# Altium schematic sheet Acoustics Board Pg. 2.SchDoc: Sample Sheet Title
size B; Date: MM/DD/YYYY; Author: Nathan A, Rebecca Y, Rebecca L; Organization: ORGANIZATION; Address1: ADDRESS 1; Address2: ADDRESS 2; Address3: ADDRESS 3; Address4: ADDRESS 4; Revision: -; SheetNumber: 1; SheetTotal: 5; ENG_APP_DATE: --/--/--; DSN_APP_DATE: --/--/--; CHK_APP_DATE: --/--/--
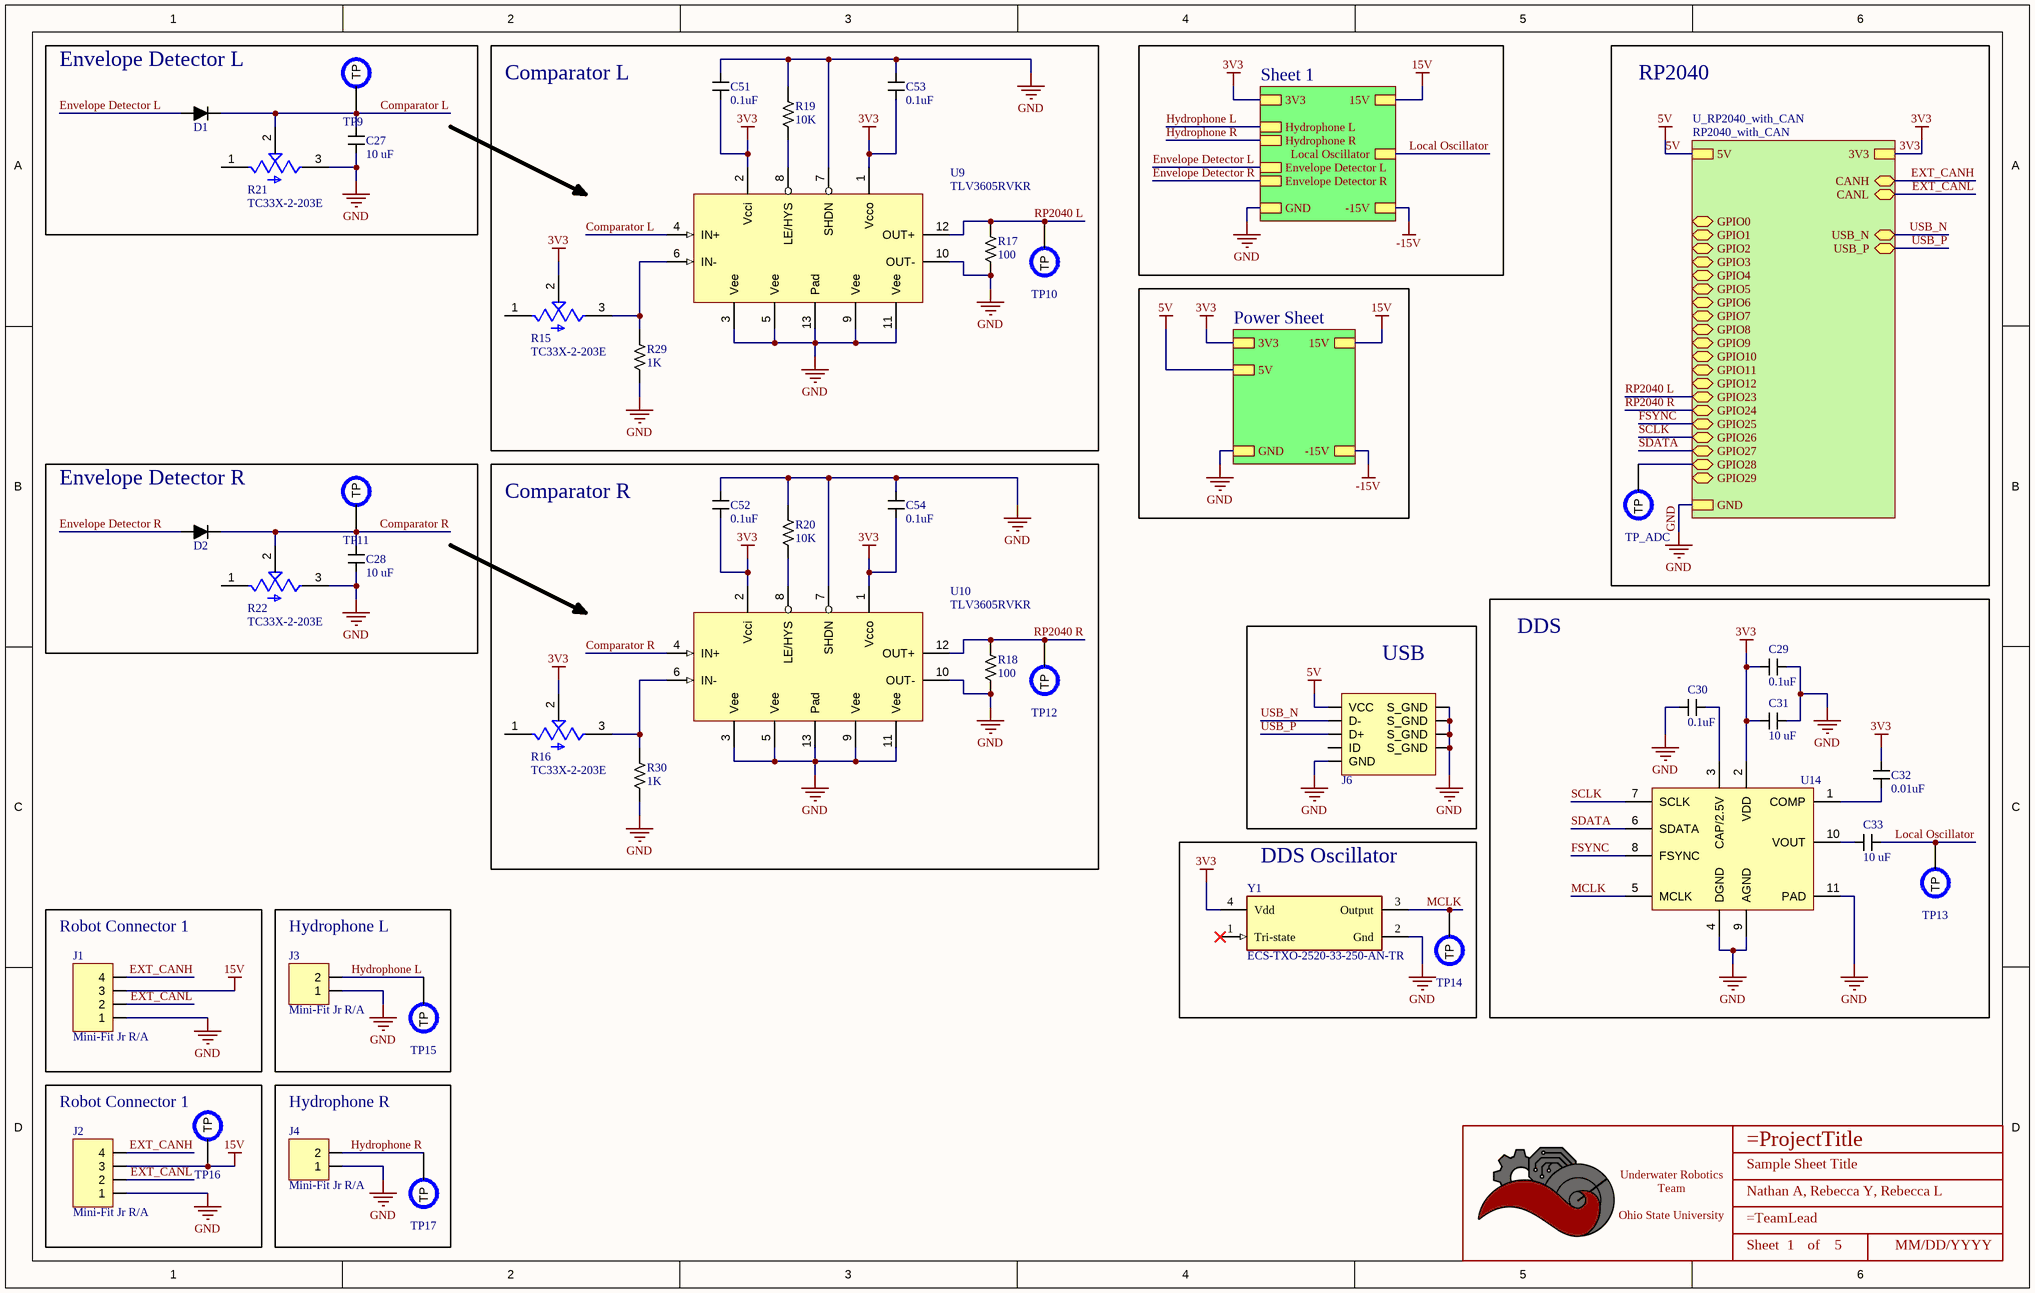
[diagram p0: Acoustics Board Pg. 2.SchDoc]

## Parts
*  Title_Block  [LOGO]  (value not drawn)  (graphical)
C27  Value (uF): 10 uF  [CAPACITOR_0603]  (hidden comment: 10uF Ceramic 6.3V)
C28  Value (uF): 10 uF  [CAPACITOR_0603]  (hidden comment: 10uF Ceramic 6.3V)
C29  value 0.1uF  [CAPACITOR_0603]  (hidden comment: 100nF Ceramic 6.3V)
C30  value 0.1uF  [CAPACITOR_0603]  (hidden comment: 100nF Ceramic 6.3V)
C31  Value (uF): 10 uF  [CAPACITOR_0603]  (hidden comment: 10uF Ceramic 6.3V)
C32  value 0.01uF  [CAPACITOR_0603]  (hidden comment: CL10B103KB8NNNC)
C33  Value (uF): 10 uF  [CAPACITOR_0603]  (hidden comment: 10uF Ceramic 6.3V)
C51  value 0.1uF  [CAPACITOR_0603]  (hidden comment: 100nF Ceramic 6.3V)
C52  value 0.1uF  [CAPACITOR_0603]  (hidden comment: 100nF Ceramic 6.3V)
C53  value 0.1uF  [CAPACITOR_0603]  (hidden comment: 100nF Ceramic 6.3V)
C54  value 0.1uF  [CAPACITOR_0603]  (hidden comment: 100nF Ceramic 6.3V)
D1  BAR9002ELE6327XTMA1  [DIODE_0402]  (value not drawn)
D2  BAR9002ELE6327XTMA1  [DIODE_0402]  (value not drawn)
J1  Mini-Fit Jr R/A  [CONN_MOLEX_MINIFIT JR_4 POS_R/A]
J2  Mini-Fit Jr R/A  [CONN_MOLEX_MINIFIT JR_4 POS_R/A]
J3  Mini-Fit Jr R/A  [CONN_MOLEX_MINIFIT JR_2 POS_R/A]
J4  Mini-Fit Jr R/A  [CONN_MOLEX_MINIFIT JR_2 POS_R/A]
J6  USB_MICRO R/A  [CONN_MINIUSB]  (value not drawn)
R15  TC33X-2-203E  [TRIM_TC33X-2-203E]
R16  TC33X-2-203E  [TRIM_TC33X-2-203E]
R17  Value  (Ohms): 100  [RESISTOR_0603]  (hidden comment: 100 Ohm 5% 1/8W)
R18  Value  (Ohms): 100  [RESISTOR_0603]  (hidden comment: 100 Ohm 5% 1/8W)
R19  Value  (Ohms): 10K  [RESISTOR_0603]  (hidden comment: 10k Ohm 5% 1/10W)
R20  Value  (Ohms): 10K  [RESISTOR_0603]  (hidden comment: 10k Ohm 5% 1/10W)
R21  TC33X-2-203E  [TRIM_TC33X-2-203E]
R22  TC33X-2-203E  [TRIM_TC33X-2-203E]
R29  Value  (Ohms): 1K  [RESISTOR_0603]  (hidden comment: 1k Ohm 5% 1/10W)
R30  Value  (Ohms): 1K  [RESISTOR_0603]  (hidden comment: 1k Ohm 5% 1/10W)
TP9  PCB Test Point  [TESTPOINT_1.2MM]  (value not drawn)  (no BOM)
TP10  PCB Test Point  [TESTPOINT_1.2MM]  (value not drawn)  (no BOM)
TP11  PCB Test Point  [TESTPOINT_1.2MM]  (value not drawn)  (no BOM)
TP12  PCB Test Point  [TESTPOINT_1.2MM]  (value not drawn)  (no BOM)
TP13  PCB Test Point  [TESTPOINT_1.2MM]  (value not drawn)  (no BOM)
TP14  PCB Test Point  [TESTPOINT_1.2MM]  (value not drawn)  (no BOM)
TP15  PCB Test Point  [TESTPOINT_1.2MM]  (value not drawn)  (no BOM)
TP16  PCB Test Point  [TESTPOINT_1.2MM]  (value not drawn)  (no BOM)
TP17  PCB Test Point  [TESTPOINT_1.2MM]  (value not drawn)  (no BOM)
TP_ADC  PCB Test Point  [TESTPOINT_1.2MM]  (value not drawn)  (no BOM)
U9  TLV3605RVKR  [TLV3605RVKR]
U10  TLV3605RVKR  [TLV3605RVKR]
U14  IC DDS 5MHZ 10BIT 10LFCSP  [CP-10-9]  (value not drawn)
Y1  ECS-TXO-2520-33-250-AN-TR  [FP-ECS-TXO-2520-MFG]

## Blocks framed on the sheet
Envelope Detector L: C27 D1 R21 TP9
Comparator L: C51 C53 R15 R17 R19 R29 TP10 U9
RP2040: TP_ADC
Envelope Detector R: C28 D2 R22 TP11
Comparator R: C52 C54 R16 R18 R20 R30 TP12 U10
DDS: C29-C33 TP13 U14
USB: J6
DDS Oscillator: TP14 Y1
Robot Connector 1: J1
Hydrophone L: J3 TP15
Robot Connector 1: J2 TP16
Hydrophone R: J4 TP17

## Sub-sheets
Power Sheet = Acoustics Board Power.SchDoc: 3V3, 15V, -15V, GND, 5V
Sheet 1 = Acoustics Board Sheet 1.SchDoc: Hydrophone L, Hydrophone R, Envelope Detector L, Envelope Detector R, 3V3, 15V, -15V, GND, Local Oscillator
U_RP2040_with_CAN = RP2040_with_CAN: USB_P (bidir), USB_N (bidir), 5V, CANH (bidir), CANL (bidir), GPIO0 (bidir), GPIO1 (bidir), GPIO2 (bidir), GPIO3 (bidir), GPIO4 (bidir), GPIO5 (bidir), GPIO6 (bidir), GPIO7 (bidir), GPIO8 (bidir), GPIO9 (bidir), GPIO10 (bidir), GPIO11 (bidir), GPIO12 (bidir), GPIO23 (bidir), GPIO24 (bidir), GPIO25 (bidir), GPIO26 (bidir), GPIO27 (bidir), GPIO28 (bidir), GPIO29 (bidir), 3V3, GND

## Nets
3V3: C29.2 C31.1 C32.1 C51.1 C52.1 C53.1 C54.1 R15.2(W) R16.2(W) U9.1(Vcco) U9.2(Vcci) U10.1(Vcco) U10.2(Vcci) U14.2(VDD) Y1.4(Vdd) ; sheet U_RP2040_with_CAN/3V3, sheet Sheet 1/3V3, sheet Power Sheet/3V3
5V: J6.1(VCC) ; sheet U_RP2040_with_CAN/5V, sheet Power Sheet/5V
15V: J1.3 J2.3 TP16.TP ; sheet Sheet 1/15V, sheet Power Sheet/15V
-15V: sheet Sheet 1/-15V, sheet Power Sheet/-15V
GND: C27.2 C28.2 C29.1 C30.1 C31.2 C51.2 C52.2 C53.2 C54.2 J1.1 J2.1 J3.1 J4.1 J6.5(GND) J6.6(S_GND) J6.7(S_GND) J6.8(S_GND) J6.9(S_GND) R17.2 R18.2 R19.1 R20.1 R21.3(CW) R22.3(CW) R29.2 R30.2 U9.3(Vee) U9.5(Vee) U9.7(SHDN) U9.9(Vee) U9.10(OUT-) U9.11(Vee) U9.13(Pad) U10.3(Vee) U10.5(Vee) U10.7(SHDN) U10.9(Vee) U10.10(OUT-) U10.11(Vee) U10.13(Pad) U14.4(DGND) U14.9(AGND) U14.11(PAD) Y1.2(Gnd) ; sheet U_RP2040_with_CAN/GND, sheet Sheet 1/GND, sheet Power Sheet/GND
Comparator L: C27.1 D1.2 R21.2(W) TP9.TP U9.4(IN+)
Comparator R: C28.1 D2.2 R22.2(W) TP11.TP U10.4(IN+)
Envelope Detector L: D1.1 ; sheet Sheet 1/Envelope Detector L
Envelope Detector R: D2.1 ; sheet Sheet 1/Envelope Detector R
EXT_CANH: J1.4 J2.4 ; sheet U_RP2040_with_CAN/CANH
EXT_CANL: J1.2 J2.2 ; sheet U_RP2040_with_CAN/CANL
FSYNC: U14.8(FSYNC) ; sheet U_RP2040_with_CAN/GPIO25
Hydrophone L: J3.2 TP15.TP ; sheet Sheet 1/Hydrophone L
Hydrophone R: J4.2 TP17.TP ; sheet Sheet 1/Hydrophone R
Local Oscillator: C33.2 TP13.TP ; sheet Sheet 1/Local Oscillator
MCLK: TP14.TP U14.5(MCLK) Y1.3(Output)
RP2040 L: R17.1 TP10.TP U9.12(OUT+) ; sheet U_RP2040_with_CAN/GPIO23
RP2040 R: R18.1 TP12.TP U10.12(OUT+) ; sheet U_RP2040_with_CAN/GPIO24
SCLK: U14.7(SCLK) ; sheet U_RP2040_with_CAN/GPIO26
SDATA: U14.6(SDATA) ; sheet U_RP2040_with_CAN/GPIO27
USB_N: J6.2(D-) ; sheet U_RP2040_with_CAN/USB_N
USB_P: J6.3(D+) ; sheet U_RP2040_with_CAN/USB_P
NetC30_2: C30.2 U14.3(CAP/2.5V)
NetC32_2: C32.2 U14.1(COMP)
NetC33_1: C33.1 U14.10(VOUT)
NetR15_3: R15.3(CW) R29.1 U9.6(IN-)
NetR16_3: R16.3(CW) R30.1 U10.6(IN-)
NetR19_2: R19.2 U9.8(LE/HYS)
NetR20_2: R20.2 U10.8(LE/HYS)
NetTP_ADC_TP: TP_ADC.TP ; sheet U_RP2040_with_CAN/GPIO28

Not connected (* = marked no-connect by the designer): J6 4(ID); R15 1(CCW); R16 1(CCW); R21 1(CCW); R22 1(CCW); Y1 1(Tri-state)*

## Notes on the sheet
- DWG. NO.
- REV.
- SHT.
- THIS DOCUMENT AND THE DATA DISCLOSED HEREIN OR HEREWITH IS THE PROPERTY OF ALTIUM LIMITED AND MAY BE FREELY DISTRIBUTED IN WHOLE. NO RIGHTS ARE RESERVED OR EXPRESS OR IMPLIED WARANTEE GIVEN.
- REVISION
- DESCRIPTION
- DATE
- APPROVED
- ENG:
- APPROVALS
- PROJECT
- DSN:
- CHK:
- REFERENCE DOCUMENTS
- PROJECT REVISION:
- TITLE
- DOCUMENT REVISION:
- DESIGN ITEM:
- BOM:
- FAB DWG:
- PCB DWG:
- ASSY DWG:
- SCALE:
- SIZE
- B
- CAGE CODE
- FILE NAME
- DWG NO.
- SHEET
- OF
- REV
- (in symbol Title_Block) Underwater Robotics Team / Ohio State University; Sheet; of

## Library data of the parts
* = Title_Block: UWRT Schematic Title Block Template / Created June 2021, Dylan Trainor
C27 C28 C31 C33 = CAPACITOR_10uF_0603: Cap 10uF 6.3V +/-20% / Ceramic 0603; Made By: Flip B; ComponentLink1Description: Digikey; ComponentLink1URL: https://www.digikey.com/en/products/detail/samsung-electro-mechanics/CL10A106MQ8NNNC/3886777; Supplier 1: Digi-Key; Supplier Part Number 1: 1276-1119-1-ND; Tolerance: +/- 20%; Voltage: 6.3V
C29 C30 C51-C54 = CAPACITOR_0.1uF_0603: Cap 100nF 6.3V +/-10% / Ceramic 0603; Made By: Flip B; ComponentLink1Description: Datsheet; ComponentLink1URL: https://www.mouser.com/datasheet/2/212/KEM_C1002_X7R_SMD-1102033.pdf; Tolerance: +/- 10%; Voltage: 6.3V; Supplier 1: Digi-Key; Supplier Part Number 1: 399-15351-1-ND
C32 = CAPACITOR_0.01uF_0603_50V: 10000 pF ±10% 50V Ceramic Capacitor X7R 0603 (1608 Metric); Tolerance: +/- 10%; Voltage: 6.3V; Made By: Flip B; ComponentLink1Description: Datsheet; ComponentLink1URL: https://www.mouser.com/datasheet/2/212/KEM_C1002_X7R_SMD-1102033.pdf; Supplier 1: Arrow Electronics; Supplier Part Number 1: CL10B103KB8NNNC
D1 D2 = RF Diode 80V 100mA: RF Diode PIN - Single 80V 100 mA 250 mW PG-TSLP-2-19; Forward Current: 100mA; Voltage - Peak Reverse: 80V; Package: 0402
J1 J2 = CONN_MOLEX_MINIFIT JR_4POS_R/A: Molex Minifit Jr. 5569 / 4 Pos R/A Natural; Pitch: 4.2mm; Configuration: Right Angle; Current Per Pin: 13A; Number of Positions: 4; Supplier Part Number 1: WM13112-ND; Supplier 1: Digi-Key; Manufacturer: Molex; Color: Natural; Created By: Flip B; ComponentLink1Description: Datasheet; ComponentLink1URL: https://www.molex.com/pdm_docs/sd/026013115_sd.pdf; Series: Minifit Jr 5569
J3 J4 = CONN_MOLEX_MINIFIT JR_2POS_R/A: Molex Minifit Jr. 5569 / 2 Pos R/A Natural; Pitch: 4.2mm; Configuration: Right Angle; Current Per Pin: 13A; Number of Positions: 2; Manufacturer: Molex; Color: Natural; Created By: Robert P; ComponentLink1Description: Datasheet; ComponentLink1URL: https://www.molex.com/pdm_docs/sd/026013115_sd.pdf; Series: Minifit Jr 5569; Supplier 1: Digi-Key; Supplier Part Number 1: WM1351-ND
J6 = CONN_MICROUSB: Amphenol Micro USB-B / USB2.0 5 Pin Right Angle SMD; Pitch: 0.65mm; Current Per Pin: 1.8A; Number of Positions: 5; Manufacturer: Amphenol; Configuration: Right Angle; Color: Silver; Created By: Flip B; ComponentLink1Description: Datasheet; ComponentLink1URL: https://cdn.amphenol-icc.com/media/wysiwyg/files/documentation/datasheet/inputoutput/io_usb_micro.pdf?__cf_chl_jschl_tk__=05693735e19256298f6ef6ca2bb2e65c376a4f56-1625503833-0-Abitsb0-ufjOXJYs_S3J3r2iTn-nObalbmXUksF1VvO_h_WEmRdMlUD1I8-hmWSEVWzY1pirKnrPZWfgY3851qyBZe5ZvnNQePLGIzUgdEIQBVUyW36RsbYpDLEWxJ4horD-5gChFgobLYqwmG5aHl0E8lIn_twwPPrOxilK2gP0q9t_CNOs_u5fMqXvXUrlsOv8tIE2NRlu6NVP8qtkL2GjhlkeTUbDMF8WvvpPDTFOgvZ4Y16Ej8F8AhWos88mo5B1HssXozw0XrkJQIqERITUu6rqloz9kf4ZzhBHtDAt-IkiAFY_Ds9SW8FYKKTtINJVpHZQ6Gyu1FFM4Dc9MO0maE8_mmNcwlxqyRoRk_MPWW8VyByXWM5RSp52jteRKw7FeI9WIYvCbPAOy0Eyib-aseIQsnGbglBcUY6_2xp8GYaJM38H3dNvBPsSOfJBPndKedwKHllxjkucXn6xsN0sDXkpGN-cu8_2bDTJ0g-uUucKSCooYX-ApSDNGpkA_p9zv1SOAD8c0zaZVmtiBsN75QpVz2rzq9_BFxOywPvR; Series: 10118192; Supplier 1: Digi-Key; Supplier Part Number 1: 609-4613-1-ND
R15 R16 R21 R22 = TC33X-2-203E: 20 kOhms 0.1W, 1/10W J Lead Surface Mount Trimmer Potentiometer Cermet 1 Turn Top Adjustment; MF: Bourns; Value: *; SnapEDA_Link: https://www.snapeda.com/parts/TC33X-2-203E/Bourns/view-part/312812/?ref=snap; Check_prices: https://www.snapeda.com/parts/TC33X-2-203E/Bourns/view-part/312812/?ref=eda; Digi-Key_Part_Number: TC33X-2-203ECT-ND; Purchase-URL: https://pricing.snapeda.com/search/part/TC33X-2-203E/?ref=eda; Package: 1608 Bourns; MP: TC33X-2-203E
R17 R18 = RESISTOR_100_0603_1: RES 100 OHM 5% 1/8W 0603; Tolerance: +/- 5%; Made By: Flip B; ComponentLink1Description: Digikey; ComponentLink1URL: https://www.digikey.com/en/products/detail/koa-speer-electronics-inc/RK73B1JTTD101J/9844701; Wattage: 1/8W
R19 R20 = RESISTOR_10K_0603: RES 10k OHM 5% 1/10W 0603; Tolerance: +/- 5%; Wattage: 1/8W; Made By: Robert Pafford; ComponentLink1Description: Datasheet; ComponentLink1URL: https://www.bourns.com/docs/product-datasheets/CRxxxxx.pdf; Supplier: Digikey; Digikey Part Numer: CR0603-JW-104ELFTR-ND; Supplier 1: Digi-Key; Supplier Part Number 1: 2019-RK73B1JTTD103JCT-ND
R29 R30 = RESISTOR_1K_0.5%_0603: RES 1k OHM 0.5% 1/10W 0603; Tolerance: +/- 0.5%; Made By: Robert Pafford; Wattage: 1/10W; Supplier: Digikey; Digikey Part Numer: CR0603-JW-104ELFTR-ND; Supplier 1: Digi-Key; Supplier Part Number 1: 749-1693-1-ND
TP9-TP17 TP_ADC = TESTPOINT: Made By: Robert Pafford
U9 U10 = TLV3605RVKR: IC COMPARATOR 1 GEN PUR 12WQFN; Manufacturer: Texas Instruments; Supply Voltage: 2.4V ~ 5.5V; PartNumber: TLV3605RVKR; Created By: Nathan Ayer; ComponentLink1Description: Digi-Key; ComponentLink1URL: https://www.digikey.com/en/products/detail/texas-instruments/TLV3605RVKR/14123952
U14 = AD9837ACPZ: Direct Digital Synthesis IC 10 b 5 MHz 28 b Tuning 10-LFCSP-WD (3x3)
Y1 = CMP-40224-000034-1: XTAL OSC TCXO 25.0000MHZ HCMOS; RoHS Compliant: Yes